# EAGLE schematic LVE (EAGLE 6.1)

## Sheet 1 of 2
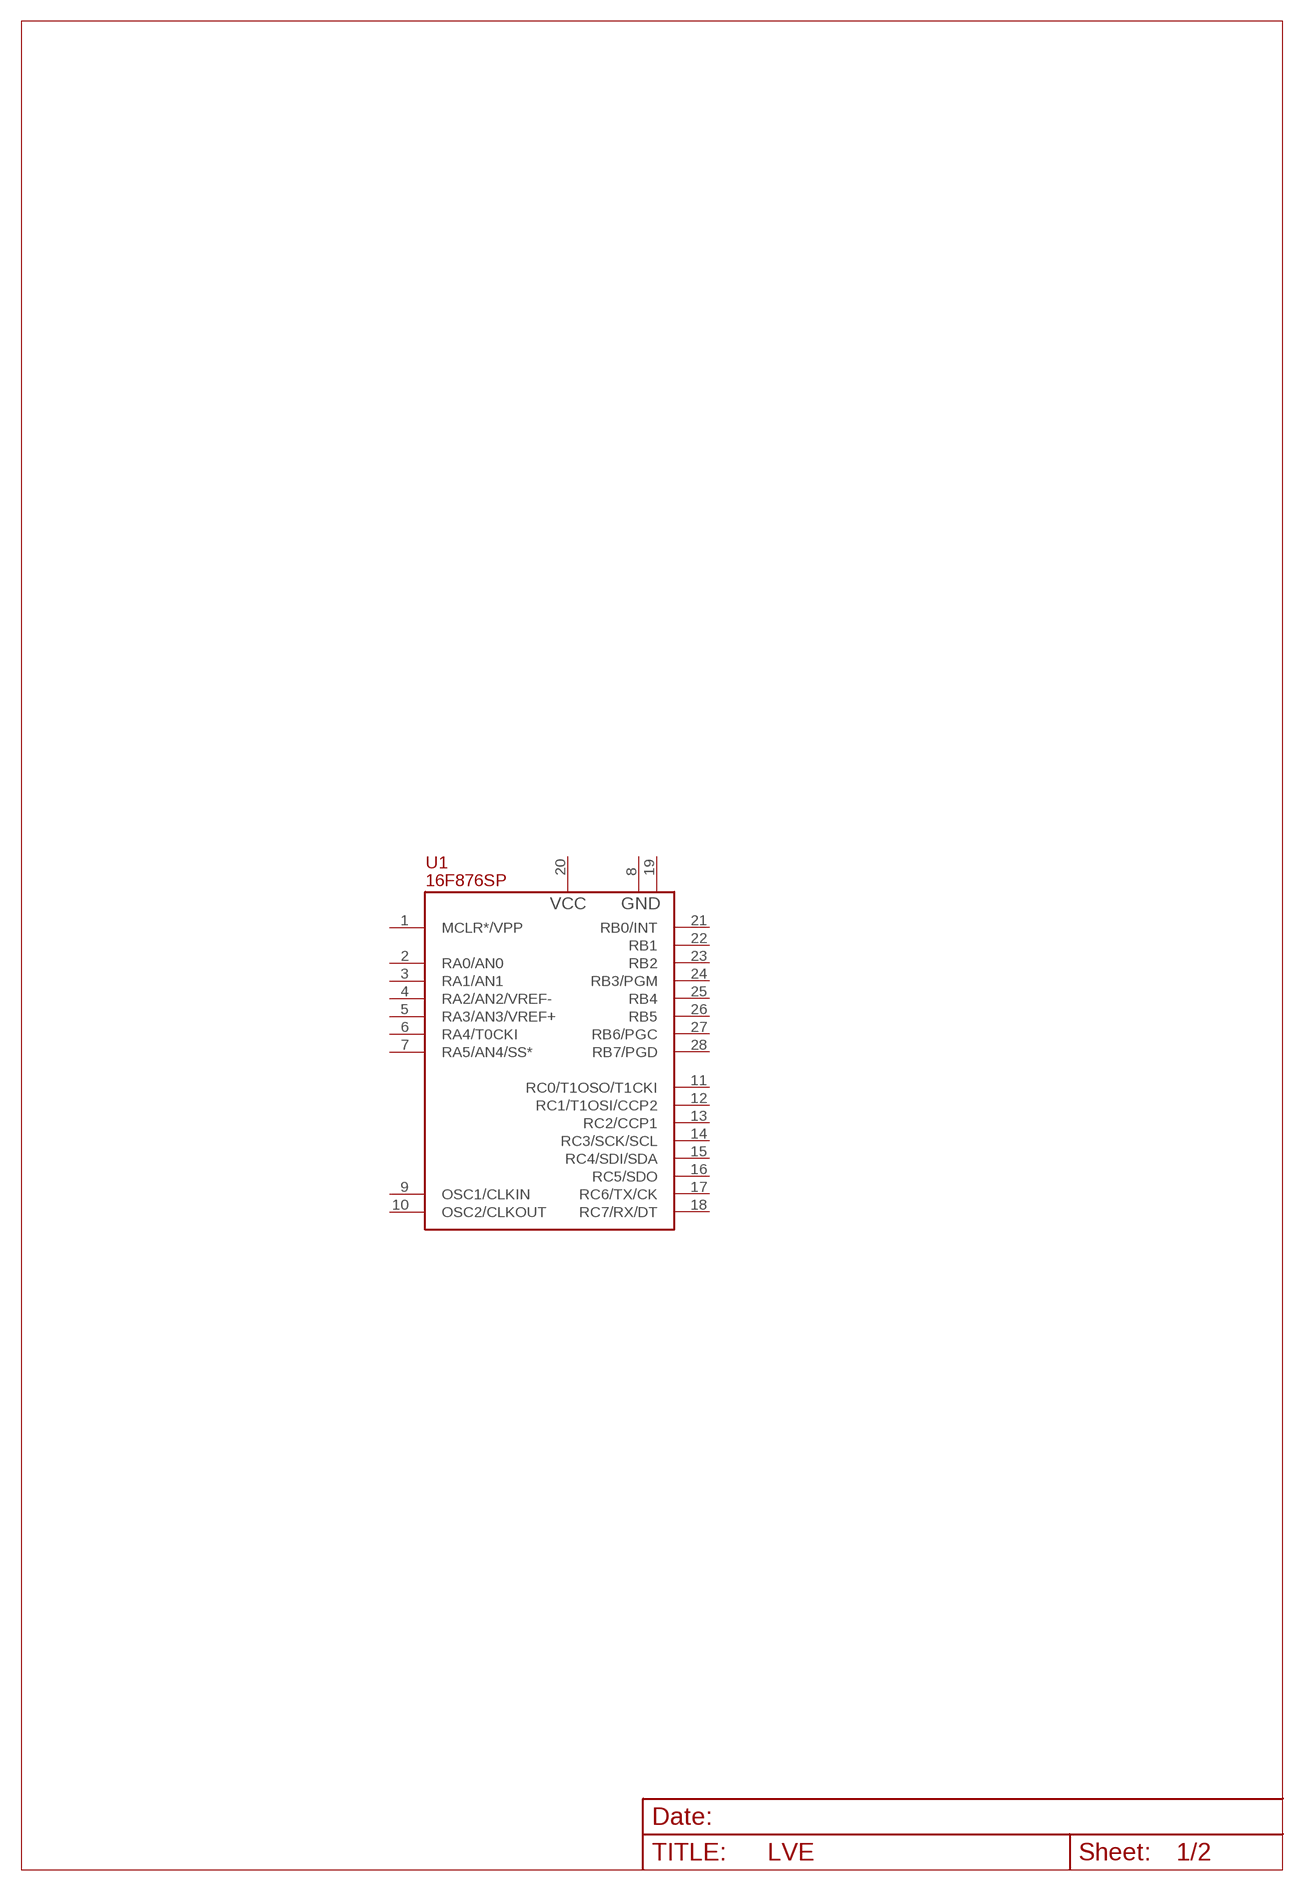
[diagram p0: schematic, sheet 1]

### Parts
U1  16F876SP  [DIL28-3]
Unconnected: U1.1(MCLR*/VPP) U1.2(RA0/AN0) U1.3(RA1/AN1) U1.4(RA2/AN2/VREF-) U1.5(RA3/AN3/VREF+) U1.6(RA4/T0CKI) U1.7(RA5/AN4/SS*) U1.8(GND) U1.9(OSC1/CLKIN) U1.10(OSC2/CLKOUT) U1.11(RC0/T1OSO/T1CKI) U1.12(RC1/T1OSI/CCP2) U1.13(RC2/CCP1) U1.14(RC3/SCK/SCL) U1.15(RC4/SDI/SDA) U1.16(RC5/SDO) U1.17(RC6/TX/CK) U1.18(RC7/RX/DT) U1.19(GND) U1.21(RB0/INT) U1.22(RB1) U1.23(RB2) U1.24(RB3/PGM) U1.25(RB4) U1.26(RB5) U1.27(RB6/PGC) U1.28(RB7/PGD)

## Sheet 2 of 2
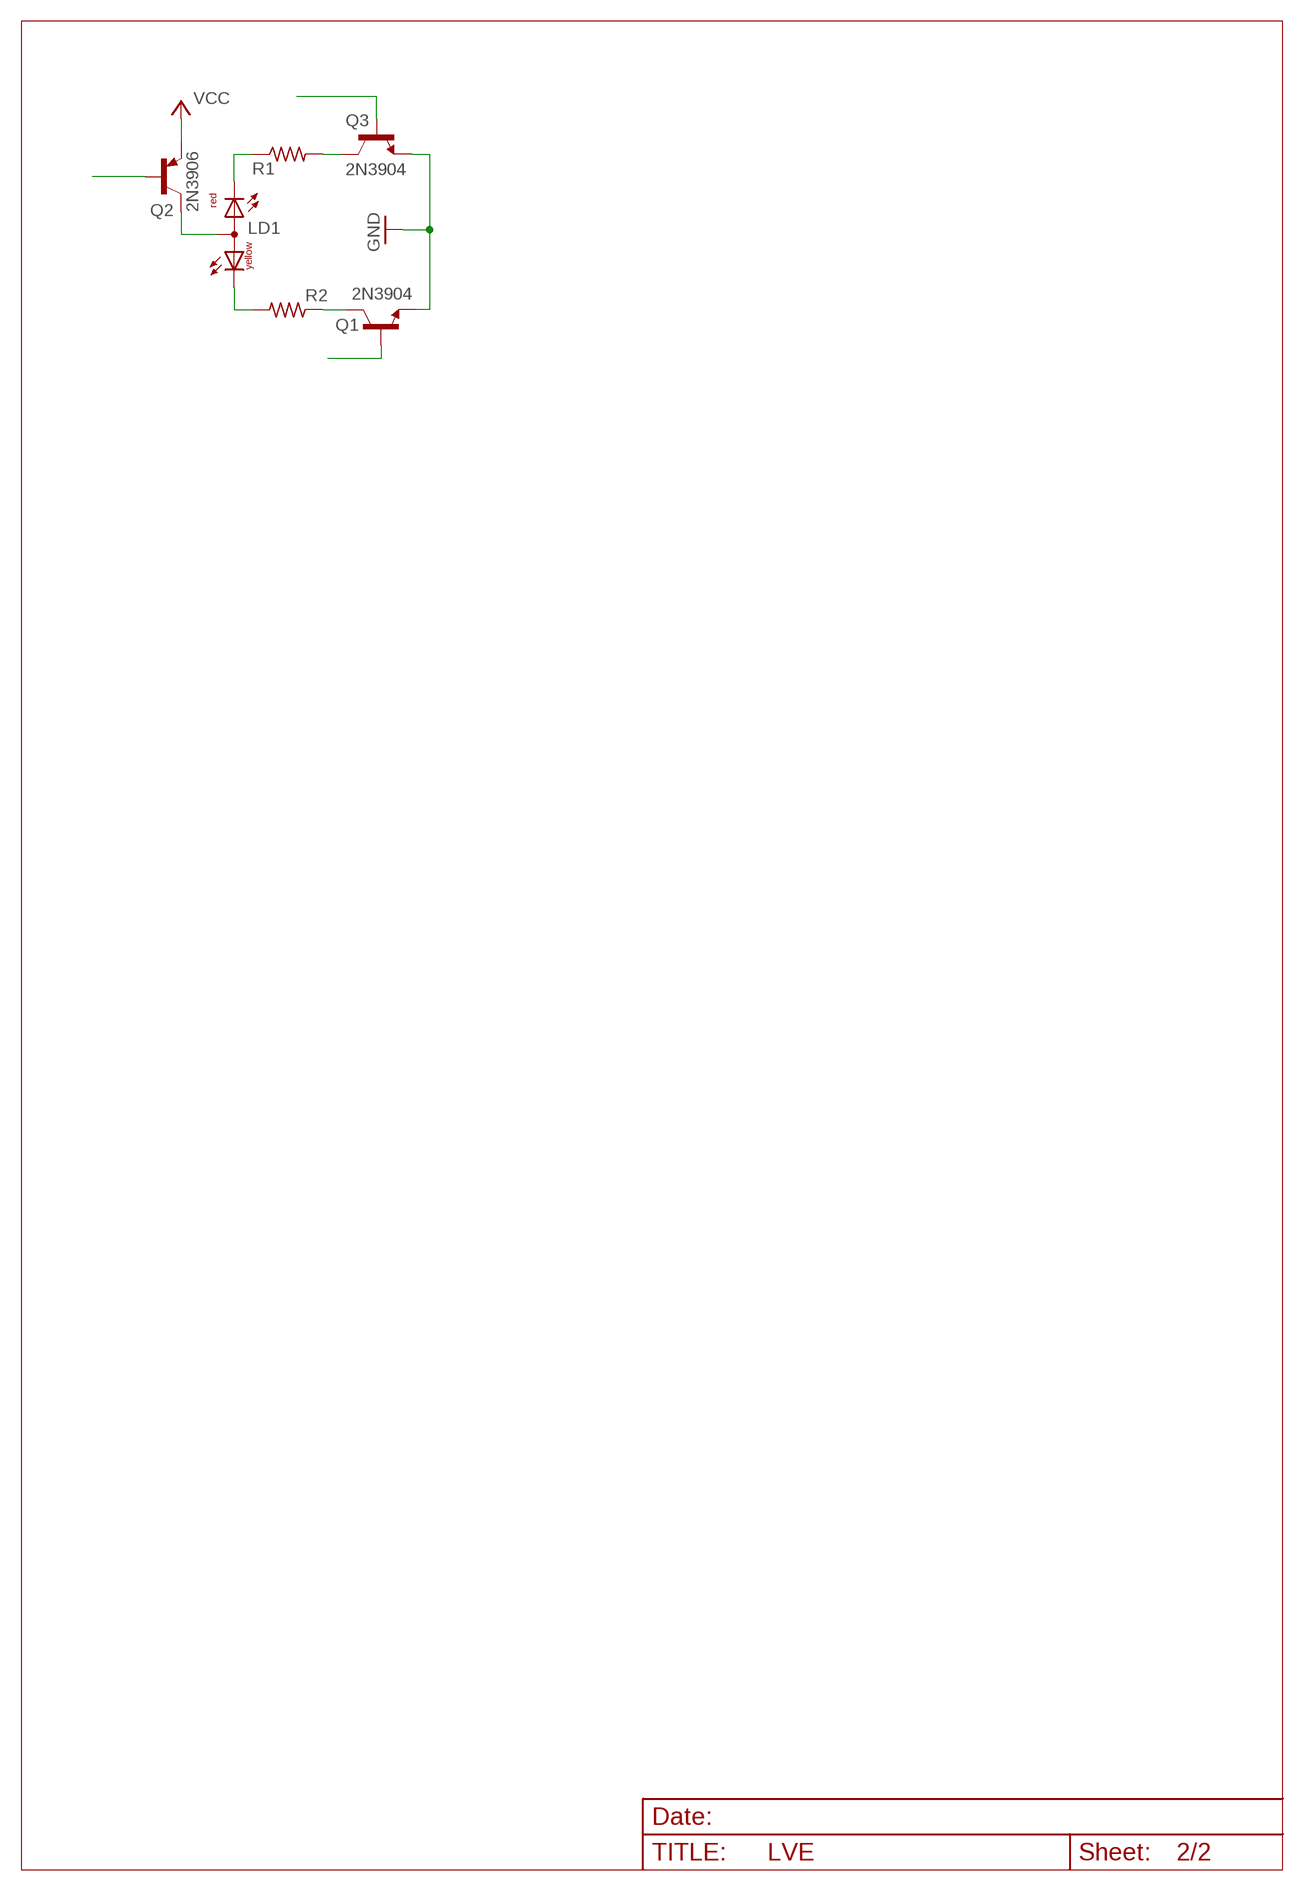
[diagram p1: schematic, sheet 2]

### Parts
LD1  DUOLED-RY-A  [DUOLED-A-5MM]
Q1  2N3904  [TO92]
Q2  2N3906  [TO92]
Q3  2N3904  [TO92]
R1  R-US_0204/5  [0204/5]
R2  R-US_0204/5  [0204/5]

### Nets
GND: Q1.3(E) Q3.3(E)
N$1: LD1.A Q2.1(C)
N$2: LD1.CR R1.1
N$3: LD1.CX(CY) R2.2
N$4: Q1.1(C) R2.1
N$5: Q3.1(C) R1.2
N$7: Q2.2(B)
N$8: Q3.2(B)
N$9: Q1.2(B)
VCC: Q2.3(E)

## Power pins joined to a net without a drawn wire
VCC: U1.20(VCC)

## Library data of the parts
LD1 = led:DUOLED-RY-A: DUO LED 2 colors (red/yellow), 5 mm, round, common Anode www.ligitek.com or other producers.
Q1 Q3 = -redpic-diode-transistor:2N3904: NPN Transistor
Q2 = -redpic-diode-transistor:2N3906: PNP Transistor
R1 R2 = rcl:R-US_: RESISTOR, American symbol
U1 = -redpic-microchip-pic:16F876: Microchip PIC 16F876